# Altium schematic sheet LPC_Male_FMC.SchDoc: Audio Research: LPC Male FMC Conn
size A4; DrawnBy: Connor Dack; Engineer: Connor Dack; DocumentNumber: 8; Revision: 1.0; SheetNumber: 8; SheetTotal: 20
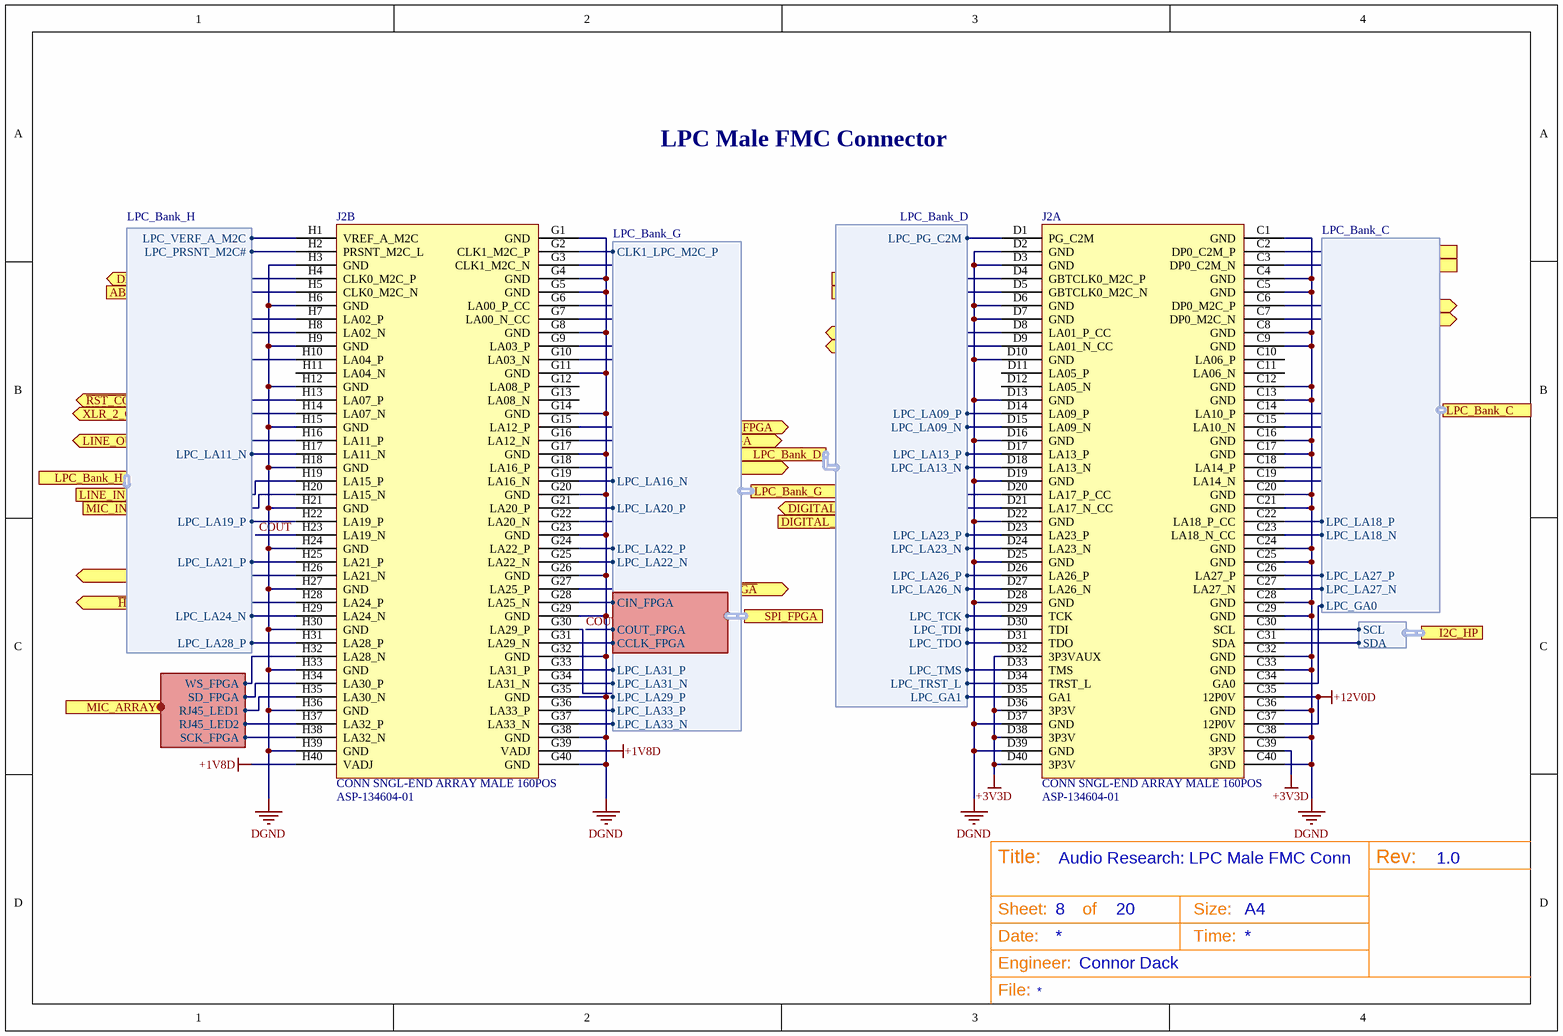
[diagram p0: LPC_Male_FMC.SchDoc]

## Parts
J2  CONN SNGL-END ARRAY MALE 160POS  [ASP-134604-01]  (parts A,B of 2)

## Ports
ABCLK_FPGA (in), ALRCLK_FPGA (in), CMD_DIR1 (out), CMD_DIR2 (out), DATA_DIR1 (out), DATA_DIR2 (out), DBCLK_FPGA (out), DIGITAL_MIC_CLK (out), DIGITAL_MIC_DATA (in), DLRCLK_FPGA (out), HP_OUT_DSDATA_FPGA (out), I2C_HP (harness I2C), LED1 (out), LED2 (out), LED3 (out), LED4 (out), LINE_IN_DSDATA_FPGA (in), LINE_OUT_DSDATA_FPGA (out), LPC_Bank_C (harness LPC_Bank_C), LPC_Bank_D (harness LPC_Bank_D), LPC_Bank_G (harness LPC_Bank_G), LPC_Bank_H (harness LPC_Bank_H), MCLKO_FPGA (in), MIC_ARRAY (harness Microphone Array), MIC_IN_DSDATA_FPGA (in), MMC0_CLK (out), MMC0_CMD (bidir), MMC0_DAT0 (bidir), MMC0_DAT1 (bidir), MMC0_DAT2 (bidir), MMC0_DAT3 (bidir), MMC0_SDCD (bidir), SPI_FPGA (harness SPI_FPGA), SW1 (in), SW2 (in), SW3 (in), SW4 (in), XLR_1_OUT_DSDATA_FPGA (out), XLR_2_OUT_DSDATA_FPGA (out), ~{CS_AUDIO_CODEC_FPGA} (out), ~{CS_PRE_AMP_FPGA} (out), ~{HEADPHONE_SD_FPGA} (out), ~{RST_CODEC_FPGA} (out)

## Harnesses
LPC_Bank_C: LPC_GA0, LPC_LA18_P, LPC_LA18_N, LPC_LA27_P, LPC_LA27_N
LPC_Bank_D: LPC_PG_C2M, LPC_TCK, LPC_TDI, LPC_TDO, LPC_TMS, LPC_TRST_L, LPC_GA1, LPC_LA13_N, LPC_LA23_P, LPC_LA23_N, LPC_LA26_P, LPC_LA26_N, LPC_LA13_P, LPC_LA09_N, LPC_LA09_P
LPC_Bank_G: LPC_LA20_P, LPC_LA22_P, LPC_LA22_N, LPC_LA31_P, LPC_LA31_N, LPC_LA33_P, LPC_LA33_N, LPC_LA29_P, CLK1_LPC_M2C_P, LPC_LA16_N
LPC_Bank_H: LPC_VERF_A_M2C, LPC_PRSNT_M2C#, LPC_LA21_P, LPC_LA24_N, LPC_LA28_P, LPC_LA19_P, LPC_LA11_N
SPI_FPGA: CIN_FPGA, COUT_FPGA, CCLK_FPGA
Microphone Array: SD_FPGA, SCK_FPGA, WS_FPGA, RJ45_LED1, RJ45_LED2
I2C: SDA, SCL

## Nets
+1V8D: J2.G39(VADJ) J2.H40(VADJ)
+3V3D: J2.C39(3P3V) J2.D32(3P3VAUX) J2.D36(3P3V) J2.D38(3P3V) J2.D40(3P3V)
+12V0D: J2.C35(12P0V) J2.C37(12P0V)
DGND: J2.C1(GND) J2.C4(GND) J2.C5(GND) J2.C8(GND) J2.C9(GND) J2.C12(GND) J2.C13(GND) J2.C16(GND) J2.C17(GND) J2.C20(GND) J2.C21(GND) J2.C24(GND) J2.C25(GND) J2.C28(GND) J2.C29(GND) J2.C32(GND) J2.C33(GND) J2.C36(GND) J2.C38(GND) J2.C40(GND) J2.D2(GND) J2.D3(GND) J2.D6(GND) J2.D7(GND) J2.D10(GND) J2.D13(GND) J2.D16(GND) J2.D19(GND) J2.D22(GND) J2.D25(GND) J2.D28(GND) J2.D37(GND) J2.D39(GND) J2.G1(GND) J2.G4(GND) J2.G5(GND) J2.G8(GND) J2.G11(GND) J2.G14(GND) J2.G17(GND) J2.G20(GND) J2.G23(GND) J2.G26(GND) J2.G29(GND) J2.G32(GND) J2.G35(GND) J2.G38(GND) J2.G40(GND) J2.H3(GND) J2.H6(GND) J2.H9(GND) J2.H12(GND) J2.H15(GND) J2.H18(GND) J2.H21(GND) J2.H24(GND) J2.H27(GND) J2.H30(GND) J2.H33(GND) J2.H36(GND) J2.H39(GND)
~{RST_CODEC_FPGA}: J2.H13(LA07_P) ; port ~{RST_CODEC_FPGA}
ABCLK_FPGA: J2.H5(CLK0_M2C_N) ; port ABCLK_FPGA
ALRCLK_FPGA: J2.G22(LA20_N) ; port ALRCLK_FPGA
~{CS_AUDIO_CODEC_FPGA}: J2.G27(LA25_P) ; port ~{CS_AUDIO_CODEC_FPGA}
~{CS_PRE_AMP_FPGA}: J2.H26(LA21_N) ; port ~{CS_PRE_AMP_FPGA}
CMD_DIR1: J2.C19(LA14_N) ; port CMD_DIR1
CMD_DIR2: J2.C18(LA14_P) ; port CMD_DIR2
COUT: J2.H23(LA19_N) ; port SPI_FPGA.COUT_FPGA
DATA_DIR1: J2.C15(LA10_N) ; port DATA_DIR1
DATA_DIR2: J2.C14(LA10_P) ; port DATA_DIR2
DBCLK_FPGA: J2.H4(CLK0_M2C_P) ; port DBCLK_FPGA
DIGITAL_MIC_CLK: J2.D20(LA17_P_CC) ; port DIGITAL_MIC_CLK
DIGITAL_MIC_DATA: J2.D21(LA17_N_CC) ; port DIGITAL_MIC_DATA
DLRCLK_FPGA: J2.G18(LA16_P) ; port DLRCLK_FPGA
~{HEADPHONE_SD_FPGA}: J2.H28(LA24_P) ; port ~{HEADPHONE_SD_FPGA}
HP_OUT_DSDATA_FPGA: J2.G16(LA12_N) ; port HP_OUT_DSDATA_FPGA
LED1: J2.C7(DP0_M2C_N) ; port LED1
LED2: J2.D8(LA01_P_CC) ; port LED2
LED3: J2.D9(LA01_N_CC) ; port LED3
LED4: J2.C6(DP0_M2C_P) ; port LED4
LINE_IN_DSDATA_FPGA: J2.H19(LA15_P) ; port LINE_IN_DSDATA_FPGA
LINE_OUT_DSDATA_FPGA: J2.H16(LA11_P) ; port LINE_OUT_DSDATA_FPGA
MCLKO_FPGA: J2.G3(CLK1_M2C_N) ; port MCLKO_FPGA
MIC_IN_DSDATA_FPGA: J2.H20(LA15_N) ; port MIC_IN_DSDATA_FPGA
MMC0_CLK: J2.G7(LA00_N_CC) ; port MMC0_CLK
MMC0_CMD: J2.G9(LA03_P) ; port MMC0_CMD
MMC0_DAT0: J2.G10(LA03_N) ; port MMC0_DAT0
MMC0_DAT1: J2.H10(LA04_P) ; port MMC0_DAT1
MMC0_DAT2: J2.H7(LA02_P) ; port MMC0_DAT2
MMC0_DAT3: J2.H8(LA02_N) ; port MMC0_DAT3
MMC0_SDCD: J2.G6(LA00_P_CC) ; port MMC0_SDCD
SW1: J2.C2(DP0_C2M_P) ; port SW1
SW2: J2.C3(DP0_C2M_N) ; port SW2
SW3: J2.D4(GBTCLK0_M2C_P) ; port SW3
SW4: J2.D5(GBTCLK0_M2C_N) ; port SW4
XLR_1_OUT_DSDATA_FPGA: J2.G15(LA12_P) ; port XLR_1_OUT_DSDATA_FPGA
XLR_2_OUT_DSDATA_FPGA: J2.H14(LA07_N) ; port XLR_2_OUT_DSDATA_FPGA
NetJ2_C22: J2.C22(LA18_P_CC) ; port LPC_Bank_C.LPC_LA18_P
NetJ2_C23: J2.C23(LA18_N_CC) ; port LPC_Bank_C.LPC_LA18_N
NetJ2_C26: J2.C26(LA27_P) ; port LPC_Bank_C.LPC_LA27_P
NetJ2_C27: J2.C27(LA27_N) ; port LPC_Bank_C.LPC_LA27_N
NetJ2_C30: J2.C30(SCL) ; port I2C_HP.SCL
NetJ2_C31: J2.C31(SDA) ; port I2C_HP.SDA
NetJ2_C34: J2.C34(GA0) ; port LPC_Bank_C.LPC_GA0
NetJ2_D1: J2.D1(PG_C2M) ; port LPC_Bank_D.LPC_PG_C2M
NetJ2_D14: J2.D14(LA09_P) ; port LPC_Bank_D.LPC_LA09_P
NetJ2_D15: J2.D15(LA09_N) ; port LPC_Bank_D.LPC_LA09_N
NetJ2_D17: J2.D17(LA13_P) ; port LPC_Bank_D.LPC_LA13_P
NetJ2_D18: J2.D18(LA13_N) ; port LPC_Bank_D.LPC_LA13_N
NetJ2_D23: J2.D23(LA23_P) ; port LPC_Bank_D.LPC_LA23_P
NetJ2_D24: J2.D24(LA23_N) ; port LPC_Bank_D.LPC_LA23_N
NetJ2_D26: J2.D26(LA26_P) ; port LPC_Bank_D.LPC_LA26_P
NetJ2_D27: J2.D27(LA26_N) ; port LPC_Bank_D.LPC_LA26_N
NetJ2_D29: J2.D29(TCK) ; port LPC_Bank_D.LPC_TCK
NetJ2_D30: J2.D30(TDI) ; port LPC_Bank_D.LPC_TDI
NetJ2_D31: J2.D31(TDO) ; port LPC_Bank_D.LPC_TDO
NetJ2_D33: J2.D33(TMS) ; port LPC_Bank_D.LPC_TMS
NetJ2_D34: J2.D34(TRST_L) ; port LPC_Bank_D.LPC_TRST_L
NetJ2_D35: J2.D35(GA1) ; port LPC_Bank_D.LPC_GA1
NetJ2_G2: J2.G2(CLK1_M2C_P) ; port LPC_Bank_G.CLK1_LPC_M2C_P
NetJ2_G19: J2.G19(LA16_N) ; port LPC_Bank_G.LPC_LA16_N
NetJ2_G21: J2.G21(LA20_P) ; port LPC_Bank_G.LPC_LA20_P
NetJ2_G24: J2.G24(LA22_P) ; port LPC_Bank_G.LPC_LA22_P
NetJ2_G25: J2.G25(LA22_N) ; port LPC_Bank_G.LPC_LA22_N
NetJ2_G28: J2.G28(LA25_N) ; port SPI_FPGA.CIN_FPGA
NetJ2_G30: J2.G30(LA29_P) ; port LPC_Bank_G.LPC_LA29_P
NetJ2_G31: J2.G31(LA29_N) ; port SPI_FPGA.CCLK_FPGA
NetJ2_G33: J2.G33(LA31_P) ; port LPC_Bank_G.LPC_LA31_P
NetJ2_G34: J2.G34(LA31_N) ; port LPC_Bank_G.LPC_LA31_N
NetJ2_G36: J2.G36(LA33_P) ; port LPC_Bank_G.LPC_LA33_P
NetJ2_G37: J2.G37(LA33_N) ; port LPC_Bank_G.LPC_LA33_N
NetJ2_H1: J2.H1(VREF_A_M2C) ; port LPC_Bank_H.LPC_VERF_A_M2C
NetJ2_H2: J2.H2(PRSNT_M2C_L) ; port LPC_Bank_H.LPC_PRSNT_M2C#
NetJ2_H17: J2.H17(LA11_N) ; port LPC_Bank_H.LPC_LA11_N
NetJ2_H22: J2.H22(LA19_P) ; port LPC_Bank_H.LPC_LA19_P
NetJ2_H25: J2.H25(LA21_P) ; port LPC_Bank_H.LPC_LA21_P
NetJ2_H29: J2.H29(LA24_N) ; port LPC_Bank_H.LPC_LA24_N
NetJ2_H31: J2.H31(LA28_P) ; port LPC_Bank_H.LPC_LA28_P
NetJ2_H32: J2.H32(LA28_N) ; port MIC_ARRAY.WS_FPGA
NetJ2_H34: J2.H34(LA30_P) ; port MIC_ARRAY.SD_FPGA
NetJ2_H35: J2.H35(LA30_N) ; port MIC_ARRAY.RJ45_LED1
NetJ2_H37: J2.H37(LA32_P) ; port MIC_ARRAY.RJ45_LED2
NetJ2_H38: J2.H38(LA32_N) ; port MIC_ARRAY.SCK_FPGA

Not connected (* = marked no-connect by the designer): J2 C10(LA06_P) C11(LA06_N) D11(LA05_P) D12(LA05_N) G12(LA08_P) G13(LA08_N) H11(LA04_N)

## Notes on the sheet
- LPC Male FMC Connector
- Title:
- Sheet:
- of
- Size:
- A4
- Rev:
- Date:
- Engineer:
- Time:
- File:

## Library data of the parts
J2 = ASP-134604-01: Low Pin Count 10mm Male FPGA Mezzanine Card Connector; Manufacturer: Samtec; Number of Contacts: 400; Number of Positions: 160; Pitch: 0.05inch; Supplier 1: Digi-Key; Stock 1: 825; Pricing 1: 1=13.68, 10=13.224, 25=12.768, 50=12.312, 100=11.856, 250=11.628, 500=11.4 (USD); Mount: Surface Mount; Contact Plating: Nickel,Gold; Contact Material: Copper Alloy; Number of Rows: 4; Termination: SMD/SMT; Packaging: Tape and Reel; Gender: Male; Radiation Hardening: No; REACH SVHC: No SVHC; ComponentLink1URL: https://datasheet.ciiva.com/403/asp-134604-01-403751.pdf; ComponentLink1Description: https://datasheet.ciiva.com/403/asp-134604-01-403751.pdf; ComponentLink2URL: https://datasheet.ciiva.com/9532/asp-134604-01-9532665.pdf; ComponentLink2Description: https://datasheet.ciiva.com/9532/asp-134604-01-9532665.pdf; Supplier Part Number 1: SAM8732-ND; Manufacturer Part Number: ASP-134604-01